# Altium schematic sheet Sheet1.SchDoc
size A4; SheetNumber: 1; SheetTotal: 1
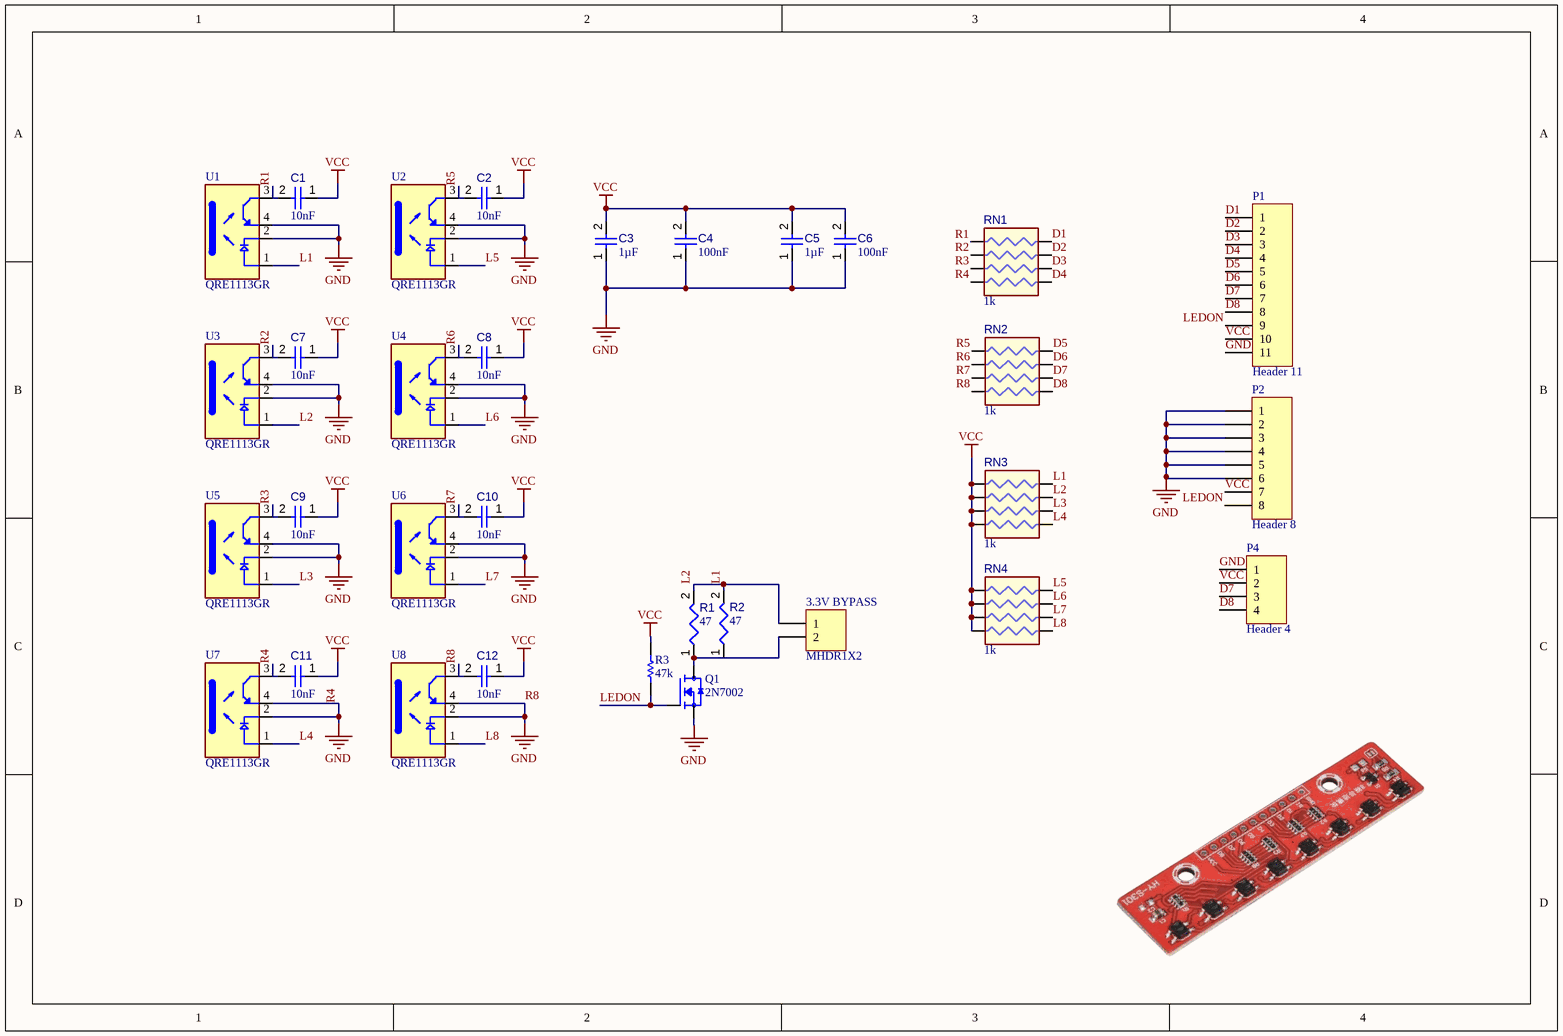
[diagram p0: Sheet1.SchDoc]

## Parts
3.3V_BYPASS  MHDR1X2  [MHDR1X2]
C1  value 10nF  [CAPC0402(1005)60_L]  (hidden comment: Capacitor 100nF +/-20% 10V 0402)
C2  value 10nF  [CAPC0402(1005)60_L]  (hidden comment: Capacitor 100nF +/-20% 10V 0402)
C3  value 1µF  [CAPC0402(1005)60_L]  (hidden comment: Capacitor 100nF +/-20% 10V 0402)
C4  value 100nF  [CAPC0402(1005)60_L]  (hidden comment: Capacitor 100nF +/-20% 10V 0402)
C5  value 1µF  [CAPC0402(1005)60_L]  (hidden comment: Capacitor 100nF +/-20% 10V 0402)
C6  value 100nF  [CAPC0402(1005)60_L]  (hidden comment: Capacitor 100nF +/-20% 10V 0402)
C7  value 10nF  [CAPC0402(1005)60_L]  (hidden comment: Capacitor 100nF +/-20% 10V 0402)
C8  value 10nF  [CAPC0402(1005)60_L]  (hidden comment: Capacitor 100nF +/-20% 10V 0402)
C9  value 10nF  [CAPC0402(1005)60_L]  (hidden comment: Capacitor 100nF +/-20% 10V 0402)
C10  value 10nF  [CAPC0402(1005)60_L]  (hidden comment: Capacitor 100nF +/-20% 10V 0402)
C11  value 10nF  [CAPC0402(1005)60_L]  (hidden comment: Capacitor 100nF +/-20% 10V 0402)
C12  value 10nF  [CAPC0402(1005)60_L]  (hidden comment: Capacitor 100nF +/-20% 10V 0402)
P1  Header 11  [HDR1X11]
P2  Header 8  [HDR1X8]
P4  Header 4  [HDR1X4]
Q1  2N7002  [TRANS_2N7002]
R1  value 47  [RESC0402(1005)_L]  (hidden comment: Resistor 9K1  +/-5 % 0402 63 mW)
R2  value 47  [RESC0402(1005)_L]  (hidden comment: Resistor 9K1  +/-5 % 0402 63 mW)
R3  value 47k  [RESC1005X40X25ML05T10]  (hidden comment: Resistor 51k +/-5% 0402 63 mW)
RN1  value 1k  [BOUR-CAY16-J4_V]  (hidden comment: CAY16-102J4LF)
RN2  value 1k  [BOUR-CAY16-J4_V]  (hidden comment: CAY16-102J4LF)
RN3  value 1k  [BOUR-CAY16-J4_V]  (hidden comment: CAY16-102J4LF)
RN4  value 1k  [BOUR-CAY16-J4_V]  (hidden comment: CAY16-102J4LF)
U1  QRE1113GR  [SOIC180P460X187-4N]
U2  QRE1113GR  [SOIC180P460X187-4N]
U3  QRE1113GR  [SOIC180P460X187-4N]
U4  QRE1113GR  [SOIC180P460X187-4N]
U5  QRE1113GR  [SOIC180P460X187-4N]
U6  QRE1113GR  [SOIC180P460X187-4N]
U7  QRE1113GR  [SOIC180P460X187-4N]
U8  QRE1113GR  [SOIC180P460X187-4N]

## Nets
GND: C3.1 C4.1 C5.1 C6.1 C11.2 C12.2 P1.11 P2.1 P2.2 P2.3 P2.4 P2.5 P2.6 P4.1 Q1.2(S) RN1.4 RN2.4 U1.2(C) U1.4(ET) U2.2(C) U2.4(ET) U3.2(C) U3.4(ET) U4.2(C) U4.4(ET) U5.2(C) U5.4(ET) U6.2(C) U6.4(ET) U7.2(C) U7.3(CT) U7.4(ET) U8.2(C) U8.3(CT) U8.4(ET)  [also labelled R4, R8]
VCC: C1.1 C2.1 C3.2 C4.2 C5.2 C6.2 C7.1 C8.1 C9.1 C10.1 C11.1 C12.1 P1.10 P2.7 P4.2 R3.2 RN3.1 RN3.2 RN3.3 RN3.4 RN4.1 RN4.2 RN4.3 RN4.4
D1: P1.1 RN1.8
D2: P1.2 RN1.7
D3: P1.3 RN1.6
D4: P1.4 RN1.5
D5: P1.5 RN2.8
D6: P1.6 RN2.7
D7: P1.7 P4.3 RN2.6
D8: P1.8 P4.4 RN2.5
L1: 3.3V_BYPASS.1 R1.2 R2.2 RN3.7 RN3.8 U1.1(A) U3.1(A)  [also labelled L2]
L3: RN3.6 U5.1(A)
L4: RN3.5 U7.1(A)
L5: RN4.8 U2.1(A)
L6: RN4.7 U4.1(A)
L7: RN4.6 U6.1(A)
L8: RN4.5 U8.1(A)
LEDON: P1.9 P2.8 Q1.1(G) R3.1
R1: C1.2 RN1.1 U1.3(CT)
R2: C7.2 RN1.2 U3.3(CT)
R3: C9.2 RN1.3 U5.3(CT)
R5: C2.2 RN2.1 U2.3(CT)
R6: C8.2 RN2.2 U4.3(CT)
R7: C10.2 RN2.3 U6.3(CT)
Net3.3V_BYPASS_2: 3.3V_BYPASS.2 Q1.3(D) R1.1

Not connected (* = marked no-connect by the designer): R2 1

## Library data of the parts
3.3V_BYPASS = CMP-002-00385-1: Header, 2-Pin; Signal Integrity: Connector; Publisher: Altium Limited; LatestRevisionDate: 17-Jul-2002; LatestRevisionNote: Re-released for DXP Platform.; Source: Miscellaneous Connectors.SchLib; Design Item ID: MHDR1X2; Component Type: Standard; Pins: 2
C1-C12 = CMP-001-00061-3: Chip Capacitor, 100nF +/-20%, 10V, 0402, Thickness 0.6 mm; Tolerance: 20%; Mounting Technology: SMT; Voltage Rating: 10V; Max Operating Temperature: 85°C; Pins: 2; Case/Package: 0402; Min Operating Temperature: -55°C
P1 = CMP-002-00098-1: Header, 11-Pin; Signal Integrity: Connector; Publisher: Altium Limited; Pins: 11; LatestRevisionNote: Re-released for DXP Platform.; Component Type: Standard; Design Item ID: Header 11; LatestRevisionDate: 17-Jul-2002; Source: Miscellaneous Connectors.SchLib
P2 = CMP-002-00188-1: Header, 8-Pin; Signal Integrity: Connector; Source: Miscellaneous Connectors.SchLib; Publisher: Altium Limited; Component Type: Standard; Pins: 8; LatestRevisionDate: 17-Jul-2002; Design Item ID: Header 8; LatestRevisionNote: Re-released for DXP Platform.
P4 = CMP-002-00168-1: Header, 4-Pin; Signal Integrity: Connector; LatestRevisionDate: 17-Jul-2002; Publisher: Altium Limited; Source: Miscellaneous Connectors.SchLib; Component Type: Standard; Design Item ID: Header 4; LatestRevisionNote: Re-released for DXP Platform.; Pins: 4
Q1 = 2N7002: MOSFET, SOT-23, N, 60V, 0.28A, 5â„¦, 150Â°C; MF: Diotec Semiconductor; SnapEDA_Link: https://www.snapeda.com/parts/2N7002/Diotec/view-part/?ref=snap; Package: SOT-23 Diotec; Value: *; MP: 2N7002; Check_prices: https://www.snapeda.com/parts/2N7002/Diotec/view-part/?ref=eda
R1 R2 = CMP-009-00135-3: Chip Resistor, 9,1 kOhms, +/-5 %, 63 mW, -55 to 155 degC, 0402; Power: 63mW; Tolerance: 5%; Pins: 2; Case/Package: 0402; Max Operating Temperature: 155°C; Min Operating Temperature: -55°C
R3 = CMP-009-00000-5: Chip Resistor, 51 KOhm, +/- 5%, 0.063 W, -55 to 155 degC, 0402 (1005 Metric); Power: 63mW; Case/Package: 0402; Min Operating Temperature: -55°C; Mounting Technology: SM; RoHS Compliant: True; Max Operating Temperature: 155°C; Tolerance: 5%; Pins: 2
RN1-RN4 = CMP-009-00042-4: Chip Resistor Array, 1 KOhm, +/- 5%, 62.5 mW, -55 to 125 degC, 8-Pin SMD, RoHS, Tape and Reel; Manufacturer: Bourns; Elements: 4; Voltage Rating: 50V; Power: 250mW; Package Quantity: 5000; Mounting Technology: SM; Manufacturer URL: http://www.bourns.com/; Max Operating Temperature: 125°C; Datasheet Version: Sep-14; Package Reference: CAY16-J4; Datasheet URL: http://www.bourns.com/pdfs/CATCAY.pdf; RoHS Compliant: True; Packaging: TapeandReel; Package Description: 8-Pin Surface Mount Device, Body 1.6 x 3.2 mm, Pitch 0.8 mm; Min Operating Temperature: -55°C; Case/Package: 1205; Pins: 8; Tolerance: 5%
U1-U8 = QRE1113GR: Reflective Optical Sensor 0.039 (1mm) 4-SMD, Gull Wing; MF: ON Semiconductor; Package: ARUSM-313-4 ON Semiconductor; Price: None; Check_prices: https://www.snapeda.com/parts/QRE1113GR/Onsemi/view-part/?ref=eda; Value: *; SnapEDA_Link: https://www.snapeda.com/parts/QRE1113GR/Onsemi/view-part/?ref=snap; MP: QRE1113GR; Availability: In Stock; Purchase-URL: https://pricing.snapeda.com/search/part/QRE1113GR/?ref=eda